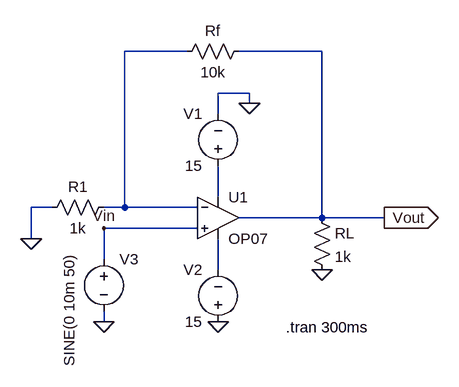
[diagram p0: schematic Non_inv_amp_opamp.asc]
Non_inv_amp_opamp.asc, the LTspice schematic file:
Version 4.1
SHEET 1 880 680
WIRE 80 -128 -16 -128
WIRE 288 -128 160 -128
WIRE 176 -64 128 -64
WIRE 176 -48 176 -64
WIRE 128 -32 128 -64
WIRE 128 96 128 48
WIRE -128 112 -160 112
WIRE -16 112 -16 -128
WIRE -16 112 -48 112
WIRE 96 112 -16 112
WIRE 288 128 288 -128
WIRE 288 128 160 128
WIRE 384 128 288 128
WIRE 96 144 -48 144
WIRE -160 160 -160 112
WIRE -48 192 -48 144
WIRE 128 208 128 160
WIRE -48 288 -48 272
FLAG 128 288 0
FLAG -160 160 0
FLAG 176 -48 0
FLAG 288 208 0
FLAG -48 288 0
FLAG 384 128 Vout
IOPIN 384 128 Out
FLAG -48 144 Vin
SYMBOL voltage 128 64 R180
WINDOW 0 24 96 Left 2
WINDOW 3 24 16 Left 2
WINDOW 123 0 0 Left 0
WINDOW 39 0 0 Left 0
SYMATTR InstName V1
SYMATTR Value 15
SYMBOL voltage 128 304 R180
WINDOW 0 24 96 Left 2
WINDOW 3 24 16 Left 2
WINDOW 123 0 0 Left 0
WINDOW 39 0 0 Left 0
SYMATTR InstName V2
SYMATTR Value 15
SYMBOL res -32 96 R90
WINDOW 0 0 56 VBottom 2
WINDOW 3 32 56 VTop 2
SYMATTR InstName R1
SYMATTR Value 1k
SYMBOL res 176 -144 R90
WINDOW 0 0 56 VBottom 2
WINDOW 3 32 56 VTop 2
SYMATTR InstName Rf
SYMATTR Value 10k
SYMBOL res 272 112 R0
SYMATTR InstName RL
SYMATTR Value 1k
SYMBOL voltage -48 176 R0
WINDOW 3 -53 7 VRight 2
WINDOW 123 0 0 Left 0
WINDOW 39 0 0 Left 0
SYMATTR Value SINE(0 10m 50)
SYMATTR InstName V3
SYMBOL OpAmps\\OP07 128 64 R0
SYMATTR InstName U1
TEXT 232 296 Left 2 !.tran 300ms

The netlist it stands for:
* Non_inv_amp_opamp.asc
V1 N002 0 15
V2 0 N003 15
R1 N001 0 1k
Rf Vout N001 10k
RL Vout 0 1k
V3 Vin 0 SINE(0 10m 50)
X§U1 Vin N001 N002 N003 Vout LT1001  ; OP07, pins In+ In- V+ V- OUT
.tran 300ms
.lib LTC.lib
.backanno
.end